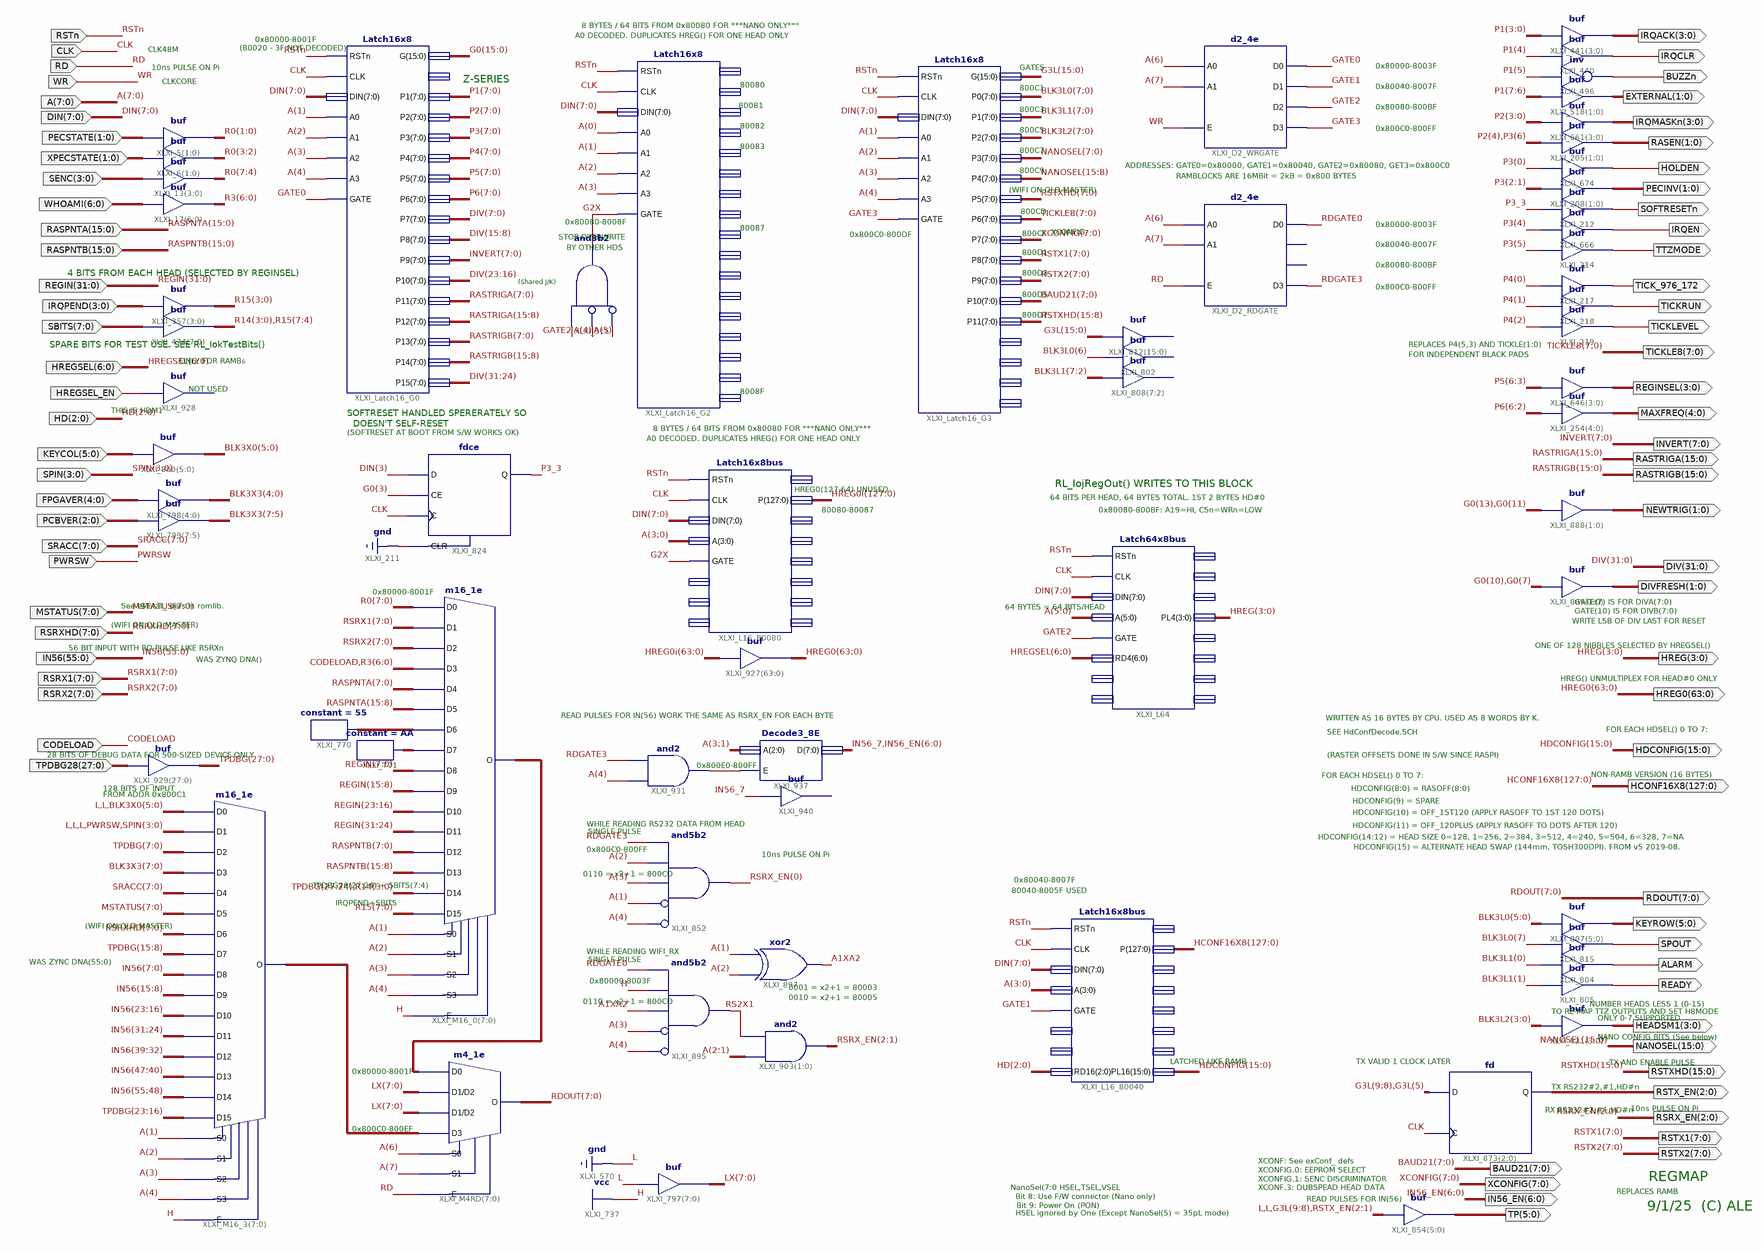
[diagram p0: schematic sheet 1]
// Xilinx ISE schematic RegMap.sch (spartan6) as structural Verilog: 63 symbols, 75 ports
module RegMap (
  input  WR,
  input  [7:0] DIN,
  input  RSTn,
  input  RD,
  input  HREGSEL_EN,
  input  [7:0] SRACC,
  input  [7:0] MSTATUS,
  input  [7:0] RSRXHD,
  input  CLK,
  input  [1:0] XPECSTATE,
  input  [1:0] PECSTATE,
  input  [3:0] SENC,
  input  [6:0] WHOAMI,
  input  [15:0] RASPNTA,
  input  [15:0] RASPNTB,
  input  [3:0] IRQPEND,
  input  [31:0] REGIN,
  input  [7:0] SBITS,
  input  [6:0] HREGSEL,
  input  [2:0] HD,
  input  [7:0] A,
  input  [4:0] FPGAVER,
  input  [2:0] PCBVER,
  input  [5:0] KEYCOL,
  input  [3:0] SPIN,
  input  PWRSW,
  input  [7:0] RSRX1,
  input  [7:0] RSRX2,
  input  CODELOAD,
  input  [27:0] TPDBG28,
  input  [55:0] IN56,
  output [3:0] HREG,
  output [7:0] INVERT,
  output [7:0] RDOUT,
  output TTZMODE,
  output SOFTRESETn,
  output [1:0] PECINV,
  output IRQEN,
  output [3:0] IRQACK,
  output IRQCLR,
  output BUZZn,
  output [1:0] EXTERNAL,
  output [3:0] IRQMASKn,
  output [1:0] RASEN,
  output HOLDEN,
  output [3:0] REGINSEL,
  output [4:0] MAXFREQ,
  output [1:0] NEWTRIG,
  output [31:0] DIV,
  output [1:0] DIVFRESH,
  output [5:0] KEYROW,
  output ALARM,
  output READY,
  output SPOUT,
  output [3:0] HEADSM1,
  output [15:0] HDCONFIG,
  output [5:0] TP,
  output [15:0] NANOSEL,
  output [2:0] RSTX_EN,
  output [7:0] TICKLE8,
  output TICK_976_172,
  output TICKRUN,
  output TICKLEVEL,
  output [63:0] HREG0,
  output [15:0] RASTRIGA,
  output [15:0] RASTRIGB,
  output [7:0] BAUD21,
  output [15:0] RSTXHD,
  output [7:0] RSTX1,
  output [7:0] RSTX2,
  output [127:0] HCONF16X8,
  output [7:0] XCONFIG,
  output [2:0] RSRX_EN,
  output [6:0] IN56_EN
);

  wire A1XA2, G2X, GATE0, GATE1, GATE2, GATE3, IN56_7, P3_3, RDGATE0, RDGATE3, RS2X1, XLXN_2773;
  wire [3:0] R14;
  wire [5:0] BLK3X0;
  wire [6:0] R3;
  wire [7:0] BLK3L0, BLK3L1, BLK3L2, BLK3X3, LX, P1, P2, P3, P4, P5, P6, R0, R15, XLXN_2519, XLXN_2521,
       XLXN_2741, XLXN_2742;
  wire [15:0] G0, G3L;
  wire [27:0] TPDBG;
  wire [127:0] HREG0i;

  d2_4e XLXI_D2_WRGATE (.A0(A[6]), .A1(A[7]), .E(WR), .D0(GATE0), .D1(GATE1), .D2(GATE2), .D3(GATE3));
  buf XLXI_214 (TTZMODE, P3[5]);
  buf XLXI_212 (SOFTRESETn, P3_3);
  assign PECINV = P3[2:1];  // buf XLXI_208[1..0], 2 bits wide
  buf XLXI_666 (IRQEN, P3[4]);
  buf XLXI_440 (IRQCLR, P1[4]);
  assign IRQACK = P1[3:0];  // buf XLXI_441[3..0], 4 bits wide
  not XLXI_496 (BUZZn, P1[5]);
  assign EXTERNAL = P1[7:6];  // buf XLXI_518[1..0], 2 bits wide
  assign RASEN = {P2[4], P3[6]};  // buf XLXI_205[1..0], 2 bits wide
  assign IRQMASKn = P2[3:0];  // buf XLXI_661[3..0], 4 bits wide
  buf XLXI_674 (HOLDEN, P3[0]);
  assign REGINSEL = P5[6:3];  // buf XLXI_646[3..0], 4 bits wide
  assign MAXFREQ = P6[6:2];  // buf XLXI_254[4..0], 5 bits wide
  assign KEYROW = BLK3L0[5:0];  // buf XLXI_807[5..0], 6 bits wide
  buf XLXI_805 (READY, BLK3L1[1]);
  buf XLXI_804 (ALARM, BLK3L1[0]);
  buf XLXI_815 (SPOUT, BLK3L0[7]);
  assign HEADSM1 = BLK3L2[3:0];  // buf XLXI_821[3..0], 4 bits wide
  m16_1e XLXI_M16_0[7:0] (
    .D0(R0), .D1(RSRX1), .D10(REGIN[23:16]), .D11(REGIN[31:24]), .D12(RASPNTB[7:0]), .D13(RASPNTB[15:8]),
    .D14({TPDBG[27:24], R14}), .D15(R15), .D2(RSRX2), .D3({CODELOAD, R3}), .D4(RASPNTA[7:0]),
    .D5(RASPNTA[15:8]), .D6(XLXN_2741), .D7(XLXN_2742), .D8(REGIN[7:0]), .D9(REGIN[15:8]), .E(1'b1),
    .S0(A[1]), .S1(A[2]), .S2(A[3]), .S3(A[4]), .O(XLXN_2521));
  m4_1e XLXI_M4RD[7:0] (.D0(XLXN_2521), .D1(LX), .D2(LX), .D3(XLXN_2519), .E(RD), .S0(A[6]), .S1(A[7]), .O(RDOUT));
  constant #(.CValue("AA")) XLXI_771 (.O(XLXN_2742));
  constant #(.CValue("55")) XLXI_770 (.O(XLXN_2741));
  m16_1e XLXI_M16_3[7:0] (
    .D0({2'b00, BLK3X0}), .D1({3'b000, PWRSW, SPIN}), .D10(IN56[23:16]), .D11(IN56[31:24]),
    .D12(IN56[39:32]), .D13(IN56[47:40]), .D14(IN56[55:48]), .D15(TPDBG[23:16]), .D2(TPDBG[7:0]),
    .D3(BLK3X3), .D4(SRACC), .D5(MSTATUS), .D6(RSRXHD), .D7(TPDBG[15:8]), .D8(IN56[7:0]), .D9(IN56[15:8]),
    .E(1'b1), .S0(A[1]), .S1(A[2]), .S2(A[3]), .S3(A[4]), .O(XLXN_2519));
  d2_4e XLXI_D2_RDGATE (.A0(A[6]), .A1(A[7]), .E(RD), .D0(RDGATE0), .D3(RDGATE3));  // open: D1, D2
  assign TP = {2'b00, G3L[9:8], RSTX_EN[2:1]};  // buf XLXI_854[5..0], 6 bits wide
  assign LX = {8{1'b0}};  // buf XLXI_797[7..0], 8 bits wide
  fd XLXI_873[2:0] (.C(CLK), .D({G3L[9:8], G3L[5]}), .Q(RSTX_EN));
  buf XLXI_217 (TICK_976_172, P4[0]);
  buf XLXI_218 (TICKRUN, P4[1]);
  buf XLXI_219 (TICKLEVEL, P4[2]);
  assign NEWTRIG = {G0[13], G0[11]};  // buf XLXI_888[1..0], 2 bits wide
  assign DIVFRESH = {G0[10], G0[7]};  // buf XLXI_889[1..0], 2 bits wide
  assign R15[3:0] = IRQPEND;  // buf XLXI_357[3..0], 4 bits wide
  assign {R14, R15[7:4]} = SBITS;  // buf XLXI_474[7..0], 8 bits wide
  assign BLK3X3[4:0] = FPGAVER;  // buf XLXI_798[4..0], 5 bits wide
  assign BLK3X3[7:5] = PCBVER;  // buf XLXI_799[7..5], 3 bits wide
  assign BLK3X0 = KEYCOL;  // buf XLXI_800[5..0], 6 bits wide
  and XLXI_852 (RSRX_EN[0], ~A[4], ~A[1], A[3], A[2], RDGATE3);  // and5b2
  and XLXI_895 (RS2X1, ~A[4], ~A[3], A1XA2, 1'b1, RDGATE0);  // and5b2
  xor XLXI_897 (A1XA2, A[2], A[1]);
  assign RSRX_EN[2:1] = A[2:1] & {2{RS2X1}};  // and2 XLXI_903[1..0], 2 bits wide
  Latch16x8 XLXI_Latch16_G2 (
    .A0(A[0]), .A1(A[1]), .A2(A[2]), .A3(A[3]), .CLK(CLK), .DIN(DIN), .GATE(G2X), .RSTn(RSTn));  // open: G, P0, P1, P10, P11, P12, P13, P14, P15, P2, P3, P4, P5, P6, P7, P8, P9
  fdce XLXI_824 (.C(CLK), .CE(G0[3]), .CLR(1'b0), .D(DIN[3]), .Q(P3_3));
  Latch16x8 XLXI_Latch16_G3 (
    .A0(A[1]), .A1(A[2]), .A2(A[3]), .A3(A[4]), .CLK(CLK), .DIN(DIN), .G(G3L), .GATE(GATE3), .P0(BLK3L0),
    .P1(BLK3L1), .P10(BAUD21), .P11(RSTXHD[15:8]), .P2(BLK3L2), .P3(NANOSEL[7:0]), .P4(NANOSEL[15:8]),
    .P5(RSTXHD[7:0]), .P6(TICKLE8), .P7(XCONFIG), .P8(RSTX1), .P9(RSTX2), .RSTn(RSTn));  // open: P12, P13, P14, P15
  // buf XLXI_802 has open pins: I=BLK3L0[6], O=open
  // buf XLXI_812[15..0] has open pins: I=G3L, O=open
  // buf XLXI_808[7..2] has open pins: I=BLK3L1[7:2], O=open
  and XLXI_915 (G2X, ~A[5], ~A[4], GATE2);  // and3b2
  assign R0[1:0] = PECSTATE;  // buf XLXI_5[1..0], 2 bits wide
  assign R0[3:2] = XPECSTATE;  // buf XLXI_6[1..0], 2 bits wide
  assign R0[7:4] = SENC;  // buf XLXI_13[3..0], 4 bits wide
  assign R3 = WHOAMI;  // buf XLXI_17[6..0], 7 bits wide
  Latch16x8 XLXI_Latch16_G0 (
    .A0(A[1]), .A1(A[2]), .A2(A[3]), .A3(A[4]), .CLK(CLK), .DIN(DIN), .G(G0), .GATE(GATE0), .P1(P1),
    .P10(DIV[23:16]), .P11(RASTRIGA[7:0]), .P12(RASTRIGA[15:8]), .P13(RASTRIGB[7:0]), .P14(RASTRIGB[15:8]),
    .P15(DIV[31:24]), .P2(P2), .P3(P3), .P4(P4), .P5(P5), .P6(P6), .P7(DIV[7:0]), .P8(DIV[15:8]),
    .P9(INVERT), .RSTn(RSTn));  // open: P0
  assign HREG0 = HREG0i[63:0];  // buf XLXI_927[63..0], 64 bits wide
  Latch16x8bus XLXI_L16_80080 (
    .A(A[3:0]), .CLK(CLK), .DIN(DIN), .GATE(G2X), .P(HREG0i), .RSTn(RSTn));  // open: G, P16, P4, P8, PL16, PL4, PL8, RD16, RD4, RD8
  Latch16x8bus XLXI_L16_80040 (
    .A(A[3:0]), .CLK(CLK), .DIN(DIN), .GATE(GATE1), .P(HCONF16X8), .PL16(HDCONFIG), .RD16(HD), .RSTn(RSTn));  // open: G, P16, P4, P8, PL4, PL8, RD4, RD8
  Latch64x8bus XLXI_L64 (
    .A(A[5:0]), .CLK(CLK), .DIN(DIN), .GATE(GATE2), .PL4(HREG), .RD4(HREGSEL), .RSTn(RSTn));  // open: G, P, P16, P4, P8, PL16, PL8, RD16, RD8
  // buf XLXI_928 has open pins: I=HREGSEL_EN, O=open
  assign TPDBG = TPDBG28;  // buf XLXI_929[27..0], 28 bits wide
  and XLXI_931 (XLXN_2773, A[4], RDGATE3);
  Decode3_8E XLXI_937 (.A(A[3:1]), .D({IN56_7, IN56_EN}), .E(XLXN_2773));
  // buf XLXI_940 has open pins: I=IN56_7, O=open

  // Notes on the sheet:
  //   8 BYTES / 64 BITS FROM 0x80080 FOR ***NANO ONLY***
  //   A0 DECODED. DUPLICATES HREG() FOR ONE HEAD ONLY
  //   0x80000-8001F
  //   (80020 - 3F NOT DECODED)
  //   CLK48M
  //   0x80000-8003F
  //   10ns PULSE ON Pi
  //   GATES
  //   Z-SERIES
  //   CLKCORE
  //   80080
  //   0x80040-8007F
  //   800C1
  //   80081
  //   0x80080-800BF
  //   800C3
  //   80082
  //   0x800C0-800FF
  //   800C5
  //   80083
  //   800C7
  //   ADDRESSES: GATE0=0x80000, GATE1=0x80040, GATE2=0x80080, GET3=0x800C0
  //   800C9
  //   RAMBLOCKS ARE 16MBit = 2kB = 0x800 BYTES
  //   (WIFI ON OLD MASTER)
  //   800CD
  //   0x80080-8008F
  //   0x80000-8003F
  //   80087
  //   XCONFIG
  //   800CF
  //   0x800C0-800DF
  //   STOP OVERWRITE
  //   0x80040-8007F
  //   BY OTHER HDS
  //   800D1
  //   0x80080-800BF
  //   4 BITS FROM EACH HEAD (SELECTED BY REGINSEL)
  //   800D3
  //   (Shared J/K)
  //   0x800C0-800FF
  //   800D5
  //   800D7
  //   SPARE BITS FOR TEST USE. SEE RL_IokTestBits()
  //   REPLACES P4(5,3) AND TICKLE(1:0)
  //   FOR INDEPENDENT BLACK PADS
  //   ONLY FOR RAMBs
  //   NOT USED
  //   8008F
  //   THIS IS HDM1
  //   SOFTRESET HANDLED SPERERATELY SO
  //   DOESN'T SELF-RESET
  //   8 BYTES / 64 BITS FROM 0x80080 FOR ***NANO ONLY***
  //   (SOFTRESET AT BOOT FROM S/W WORKS OK)
  //   A0 DECODED. DUPLICATES HREG() FOR ONE HEAD ONLY
  //   RL_IojRegOut() WRITES TO THIS BLOCK
  //   HREG0(127-64) UNUSED
  //   64 BITS PER HEAD, 64 BYTES TOTAL. 1ST 2 BYTES HD#0
  //   80080-80087
  //   0x80080-800BF: A19=HI, CSn=WRn=LOW
  //   0x80000-8001F
  //   GATE(7) IS FOR DIVA(7:0)
  //   See eMstat_ defs in romlib.
  //   64 BYTES = 64 BITS/HEAD
  //   GATE(10) IS FOR DIVB(7:0)
  //   WRITE LSB OF DIV LAST FOR RESET
  //   (WIFI ON OLD MASTER)
  //   ONE OF 128 NIBBLES SELECTED BY HREGSEL()
  //   56 BIT INPUT WITH RD PULSE LIKE RSRXn
  //   WAS ZYNQ DNA()
  //   HREG() UNMULTIPLEX FOR HEAD#0 ONLY
  //   READ PULSES FOR IN(56) WORK THE SAME AS RSRX_EN FOR EACH BYTE
  //   WRITTEN AS 16 BYTES BY CPU. USED AS 8 WORDS BY K.
  //   FOR EACH HDSEL() 0 TO 7:
  //   SEE HdConfDecode.SCH
  //   28 BITS OF DEBUG DATA FOR 500-SIZED DEVICE ONLY
  //   (RASTER OFFSETS DONE IN S/W SINCE RASPI)
  //   0x800E0-800FF
  //   NON-RAMB VERSION (16 BYTES)
  //   FOR EACH HDSEL() 0 TO 7:
  //   128 BITS OF INPUT
  //   HDCONFIG(8:0) = RASOFF(8:0)
  //   FROM ADDR 0x800C1
  //   HDCONFIG(9) = SPARE
  //   HDCONFIG(10) = OFF_1ST120 (APPLY RASOFF TO 1ST 120 DOTS)
  //   WHILE READING RS232 DATA FROM HEAD
  //   HDCONFIG(11) = OFF_120PLUS (APPLY RASOFF TO DOTS AFTER 120)
  //   SINGLE PULSE
  //   HDCONFIG(14:12) = HEAD SIZE 0=128, 1=256, 2=384, 3=512, 4=240, 5=504, 6=328, 7=NA
  //   HDCONFIG(15) = ALTERNATE HEAD SWAP (144mm, TOSH300DPI). FROM v5 2019-08.
  //   0x800C0-800FF
  //   10ns PULSE ON Pi
  //   0110 = x2+1 = 800CD
  //   0x80040-8007F
  //   TPDBG28(27:24) + SBITS(7:4)
  //   80040-8005F USED
  //   IRQPEND+SBITS
  //   (WIFI ON OLD MASTER)
  //   WHILE READING WIFI_RX
  //   SINGLE PULSE
  //   WAS ZYNC DNA(55:0)
  //   0x80000-8003F
  //   0001 = x2+1 = 80003
  //   0010 = x2+1 = 80005
  //   0110 = x2+1 = 800CD
  //   NUMBER HEADS LESS 1 (0-15)
  //   TO RE-MAP TTZ OUTPUTS AND SET H8MODE
  //   ONLY 0-7 SUPPORTED
  //   NANO CONFIG BITS (See below)
  //   LATCHED LIKE RAMB
  //   TX VALID 1 CLOCK LATER
  //   TX AND ENABLE PULSE
  //   0x80000-8001F
  //   TX RS232#2,#1,HD#n
  //   10ns PULSE ON Pi
  //   RX RS232#2,#1,HD#n
  //   0x800C0-800EF
  //   XCONF: See exConf_ defs
  //   XCONFIG.0: EEPROM SELECT
  //   REGMAP
  //   XCONFIG.1: SENC DISCRIMINATOR
  //   NanoSel(7:0 HSEL,TSEL,VSEL
  //   XCONF.3: DUBSPEAD HEAD DATA
  //   REPLACES RAMB
  //   Bit 8: Use F/W connector (Nano only)
  //   READ PULSES FOR IN(56)
  //   Bit 9: Power On (PON)
  //   9/1/25  (C) ALE
  //   HSEL ignored by One (Except NanoSel(5) = 35pL mode)
endmodule
